# Altium schematic sheet 17-Led.SchDoc
size A4; DocumentNumber: 17; SheetNumber: 17; SheetTotal: 26
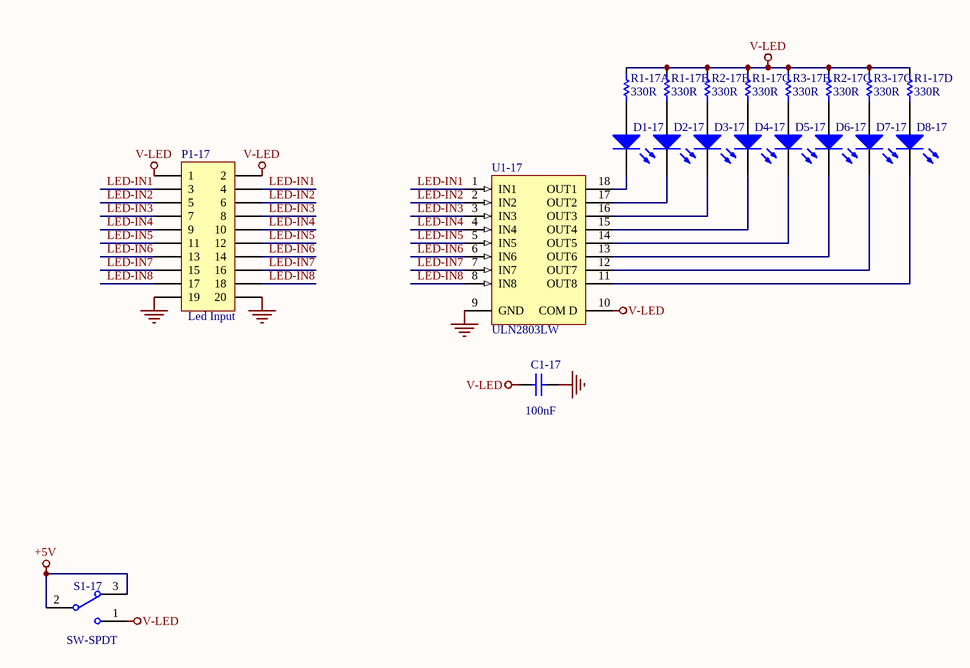
[diagram p0: 17-Led.SchDoc]

## Parts
C1-17  value 100nF  [c-0805]  (hidden comment: 104)
D1-17  LED  [LED-0805]  (value not drawn)
D2-17  LED  [LED-0805]  (value not drawn)
D3-17  LED  [LED-0805]  (value not drawn)
D4-17  LED  [LED-0805]  (value not drawn)
D5-17  LED  [LED-0805]  (value not drawn)
D6-17  LED  [LED-0805]  (value not drawn)
D7-17  LED  [LED-0805]  (value not drawn)
D8-17  LED  [LED-0805]  (value not drawn)
P1-17  value Led Input  [JP2.54-F-2x10A]  (hidden comment: H10X2)
R1-17  330R  [R-Array-0603-4]  (parts A,B,C,D of 4)
R2-17  330R  [R-Array-0603-4]  (parts B,C of 4)
R3-17  330R  [R-Array-0603-4]  (parts B,C of 4)
S1-17  SW-SPDT  [SW-SLIDE-2P-2W]
U1-17  ULN2803LW  [SOIC-18-W]

## Nets
+5V: S1-17.2 S1-17.3
GND: C1-17.2 P1-17.19 P1-17.20 U1-17.9(GND)
V-LED: C1-17.1 P1-17.1 P1-17.2 R1-17.2 R1-17.4 R1-17.6 R1-17.8 R2-17.4 R2-17.6 R3-17.4 R3-17.6 S1-17.1 U1-17.10(COM_D)
LED-IN1: P1-17.3 P1-17.4 U1-17.1(IN1)
LED-IN2: P1-17.5 P1-17.6 U1-17.2(IN2)
LED-IN3: P1-17.7 P1-17.8 U1-17.3(IN3)
LED-IN4: P1-17.9 P1-17.10 U1-17.4(IN4)
LED-IN5: P1-17.11 P1-17.12 U1-17.5(IN5)
LED-IN6: P1-17.13 P1-17.14 U1-17.6(IN6)
LED-IN7: P1-17.15 P1-17.16 U1-17.7(IN7)
LED-IN8: P1-17.17 P1-17.18 U1-17.8(IN8)
NetD1-17_1: D1-17.1(A) R1-17.1
NetD1-17_2: D1-17.2(K) U1-17.18(OUT1)
NetD2-17_1: D2-17.1(A) R1-17.3
NetD2-17_2: D2-17.2(K) U1-17.17(OUT2)
NetD3-17_1: D3-17.1(A) R2-17.3
NetD3-17_2: D3-17.2(K) U1-17.16(OUT3)
NetD4-17_1: D4-17.1(A) R1-17.5
NetD4-17_2: D4-17.2(K) U1-17.15(OUT4)
NetD5-17_1: D5-17.1(A) R3-17.3
NetD5-17_2: D5-17.2(K) U1-17.14(OUT5)
NetD6-17_1: D6-17.1(A) R2-17.5
NetD6-17_2: D6-17.2(K) U1-17.13(OUT6)
NetD7-17_1: D7-17.1(A) R3-17.5
NetD7-17_2: D7-17.2(K) U1-17.12(OUT7)
NetD8-17_1: D8-17.1(A) R1-17.7
NetD8-17_2: D8-17.2(K) U1-17.11(OUT8)

## Library data of the parts
C1-17 = Cap: Capacitor; Published: 8-Jun-2000; LatestRevisionDate: 17-Jul-2002; LatestRevisionNote: Re-released for DXP Platform.; PackageReference: RAD-0.3; Publisher: Altium Limited; PackageDescription: Radial Cap, Thru-Hole; 2 Leads; 0.3 in Pin Spacing
D1-17 D2-17 D3-17 D4-17 D5-17 D6-17 D7-17 D8-17 = LED2: Typical RED, GREEN, YELLOW, AMBER GaAs LED; Published: 8-Jun-2000; LatestRevisionDate: 17-Jul-2002; LatestRevisionNote: Re-released for DXP Platform.; PackageVersion: Feb-2002; PackageReference: 3.2X1.6X1.1; Publisher: Altium Limited; PackageDescription: SM LED; 2 Flat Leads
P1-17 = Header 10X2: Header, 10-Pin, Dual row; LatestRevisionDate: 17-Jul-2002; LatestRevisionNote: Re-released for DXP Platform.
R1-17 R2-17 R3-17 = R-8P4R: RES ARRAY 4 RES 330 OHM 1206; Manufacturer: Panasonic Electronic Components; Manufacturer Part Number: EXB-38V331JV; Digi-Key Part Number: Y9331TR-ND; Link: http://www.digikey.com/product-detail/en/EXB-38V331JV/Y9331TR-ND/256525
S1-17 = SW-SPDT: SPDT Subminiature Toggle Switch, Right Angle Mounting, Vertical Actuation; Published: 24-Mar-1999; LatestRevisionDate: 17-Dec-2003; LatestRevisionNote: Schematic revised, PCB Footprint replaced.; DatasheetVersion: 05-Dec-2000; PackageReference: TL36WW15050; Publisher: Altium Limited; PackageDescription: Switch; 4 Leads; ComponentLink1Description: Manufacturer Link; ComponentLink1URL: http://www.apem.com
U1-17 = ULN2803LW: High-Voltage, High-Current Darlington Array; Published: 13-Oct-2000; LatestRevisionDate: 13-Apr-2006; LatestRevisionNote: IPC-7351 Footprint Added.; DatasheetVersion: 1999; PackageReference: LW18; Publisher: Altium Limited; PackageDescription: 18-Pin Small Outline Integrated Circuit 1.27 mm Pitch; Code_JEDEC: MS-013-AB; ComponentLink1Description: Manufacturer Link; ComponentLink1URL: http://www.allegromicro.com/